# Altium schematic sheet Master.SchDoc
size A4
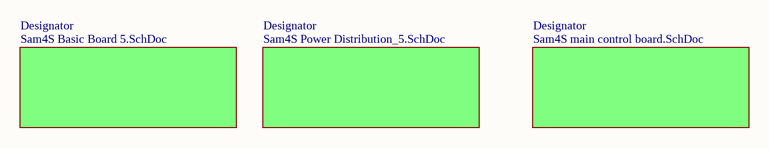
[diagram p0: Master.SchDoc]

## Sub-sheets
Designator = Sam4S Basic Board 5.SchDoc: no entries
Designator = Sam4S Power Distribution_5.SchDoc: no entries
Designator = Sam4S main control board.SchDoc: no entries